# EAGLE design ringmod_1496 (EAGLE 7.1.0)
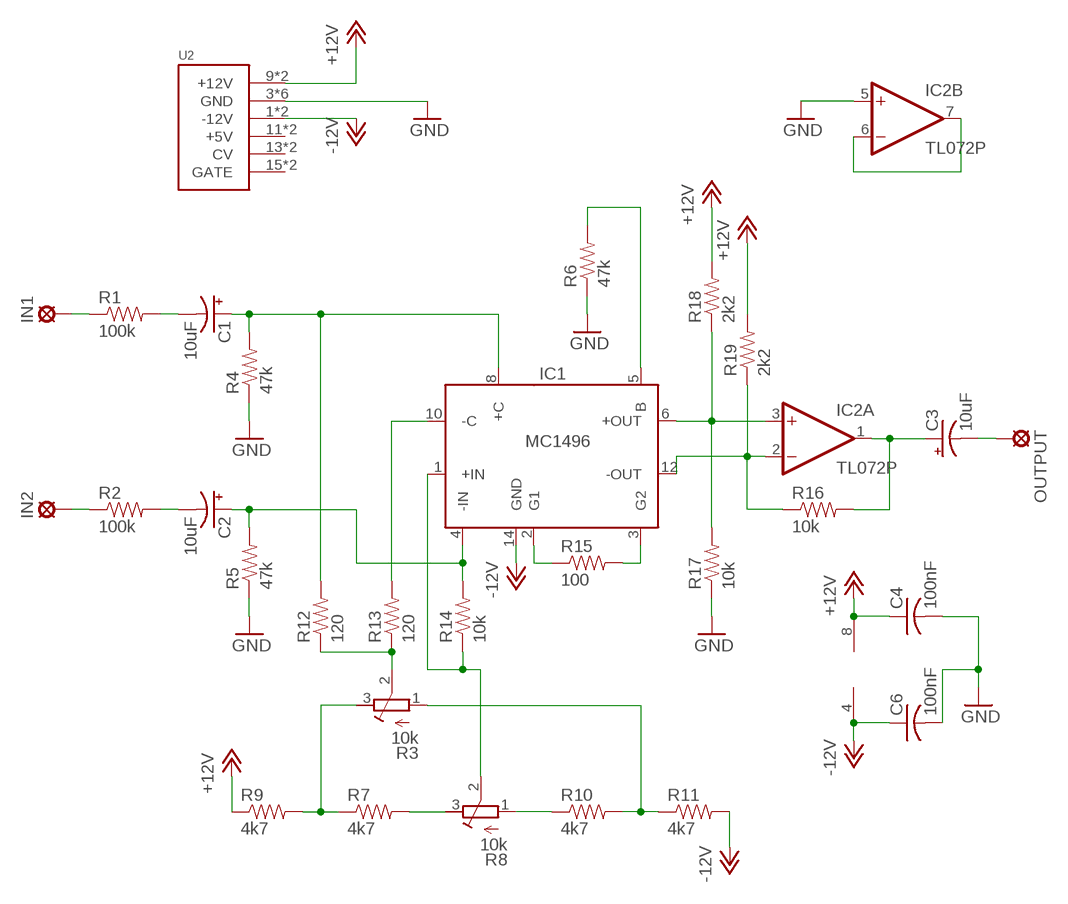
[diagram p0: schematic, sheet 1]

## Parts
C1  10uF  CPOL-USB45181A  [B45181A]
C2  10uF  CPOL-USB45181A  [B45181A]
C3  10uF  CPOL-USB45181A  [B45181A]
C4  100nF  C-US025-024X044  [C025-024X044]
C6  100nF  C-US025-024X044  [C025-024X044]
IC1  MC1496  [MC1496]
IC2  TL072P  [DIL08]
IN1  LSP11  [LSP11]
IN2  LSP11  [LSP11]
OUTPUT  LSP11  [LSP11]
R1  100k  RESISTORPTH-1/4W  [AXIAL-0.4]
R2  100k  RESISTORPTH-1/4W  [AXIAL-0.4]
R3  10k  R-TRIMM64W  [RTRIM64W]
R4  47k  RESISTORPTH-1/4W  [AXIAL-0.4]
R5  47k  RESISTORPTH-1/4W  [AXIAL-0.4]
R6  47k  RESISTORPTH-1/4W  [AXIAL-0.4]
R7  4k7  RESISTORPTH-1/4W  [AXIAL-0.4]
R8  10k  R-TRIMM64W  [RTRIM64W]
R9  4k7  RESISTORPTH-1/4W  [AXIAL-0.4]
R10  4k7  RESISTORPTH-1/4W  [AXIAL-0.4]
R11  4k7  RESISTORPTH-1/4W  [AXIAL-0.4]
R12  120  RESISTORPTH-1/4W  [AXIAL-0.4]
R13  120  RESISTORPTH-1/4W  [AXIAL-0.4]
R14  10k  RESISTORPTH-1/4W  [AXIAL-0.4]
R15  100  RESISTORPTH-1/4W  [AXIAL-0.4]
R16  10k  RESISTORPTH-1/4W  [AXIAL-0.4]
R17  10k  RESISTORPTH-1/4W  [AXIAL-0.4]
R18  2k2  RESISTORPTH-1/4W  [AXIAL-0.4]
R19  2k2  RESISTORPTH-1/4W  [AXIAL-0.4]
U2  POWER  [POWER_16]

## Nets
+12V: C4.1 IC2.8(P:V+) R9.P$1 R18.P$2 R19.P$2 U2.9(+12V) U2.10(+12V)
-12V: C6.1 IC1.14(GND) IC2.4(P:V-) R11.P$2 U2.1(-12V) U2.2(-12V)
GND: C4.2 C6.2 IC2.5(B:+IN) R4.P$1 R5.P$1 R6.P$1 R17.P$1 U2.3(GND) U2.4(GND) U2.5(GND) U2.6(GND) U2.7(GND) U2.8(GND)
N$1: IN1.MP R1.P$1
N$2: IN2.MP R2.P$1
N$3: C1.- R1.P$2
N$4: C2.- R2.P$2
N$5: R3.3(E) R7.P$1 R9.P$2
N$6: IC1.5(B) R6.P$2
N$7: C1.+ IC1.8(+C) R4.P$2 R12.P$2
N$8: C2.+ IC1.4(-IN) R5.P$2 R14.P$2
N$9: R7.P$2 R8.3(E)
N$10: R8.1(A) R10.P$1
N$11: R3.1(A) R10.P$2 R11.P$1
N$12: R3.2(S) R12.P$1 R13.P$1
N$13: IC1.10(-C) R13.P$2
N$14: IC1.1(+IN) R8.2(S) R14.P$1
N$15: IC1.2(G1) R15.P$1
N$16: IC1.3(G2) R15.P$2
N$17: C3.- OUTPUT.MP
N$18: C3.+ IC2.1(A:OUT) R16.P$2
N$19: IC1.12(-OUT) IC2.2(A:-IN) R16.P$1 R19.P$1
N$20: IC1.6(+OUT) IC2.3(A:+IN) R17.P$2 R18.P$1
N$21: IC2.6(B:-IN) IC2.7(B:OUT)
Unconnected: U2.11(+5V) U2.12(+5V) U2.13(CV) U2.14(CV) U2.15(GATE) U2.16(GATE)

## Library data of the parts
C1-C3 = rcl:CPOL-US: POLARIZED CAPACITOR, American symbol
C4 C6 = rcl:C-US: CAPACITOR, American symbol
IC1 = MC1496:MC1496: MC1496
IC2 = linear:TL072: OP AMP
IN1 IN2 OUTPUT = solpad:LSP11: SOLDER PAD drill 1.1 mm
R1 R2 R4-R7 R9-R19 = SparkFun-Resistors:RESISTOR: Resistor Basic schematic elements and footprints for 0603, 1206, and PTH resistors.
R3 R8 = rcl:R-TRIMM: Trimm resistor
U2 = eurorack:POWER

## Board
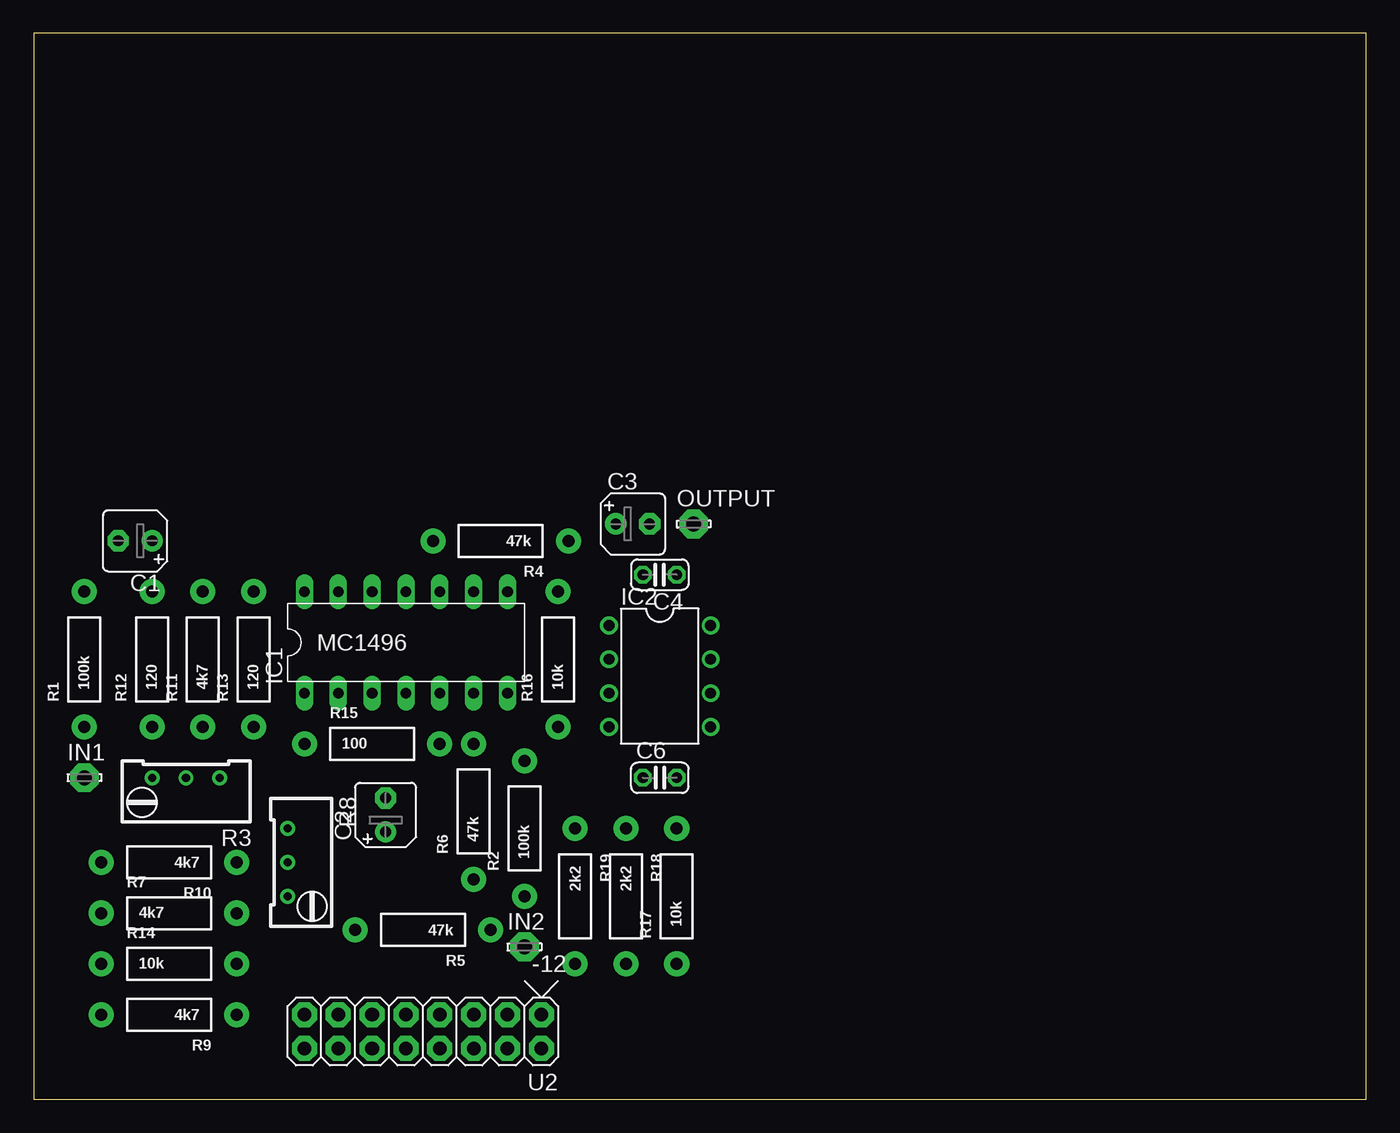
[diagram p1: board, top side]
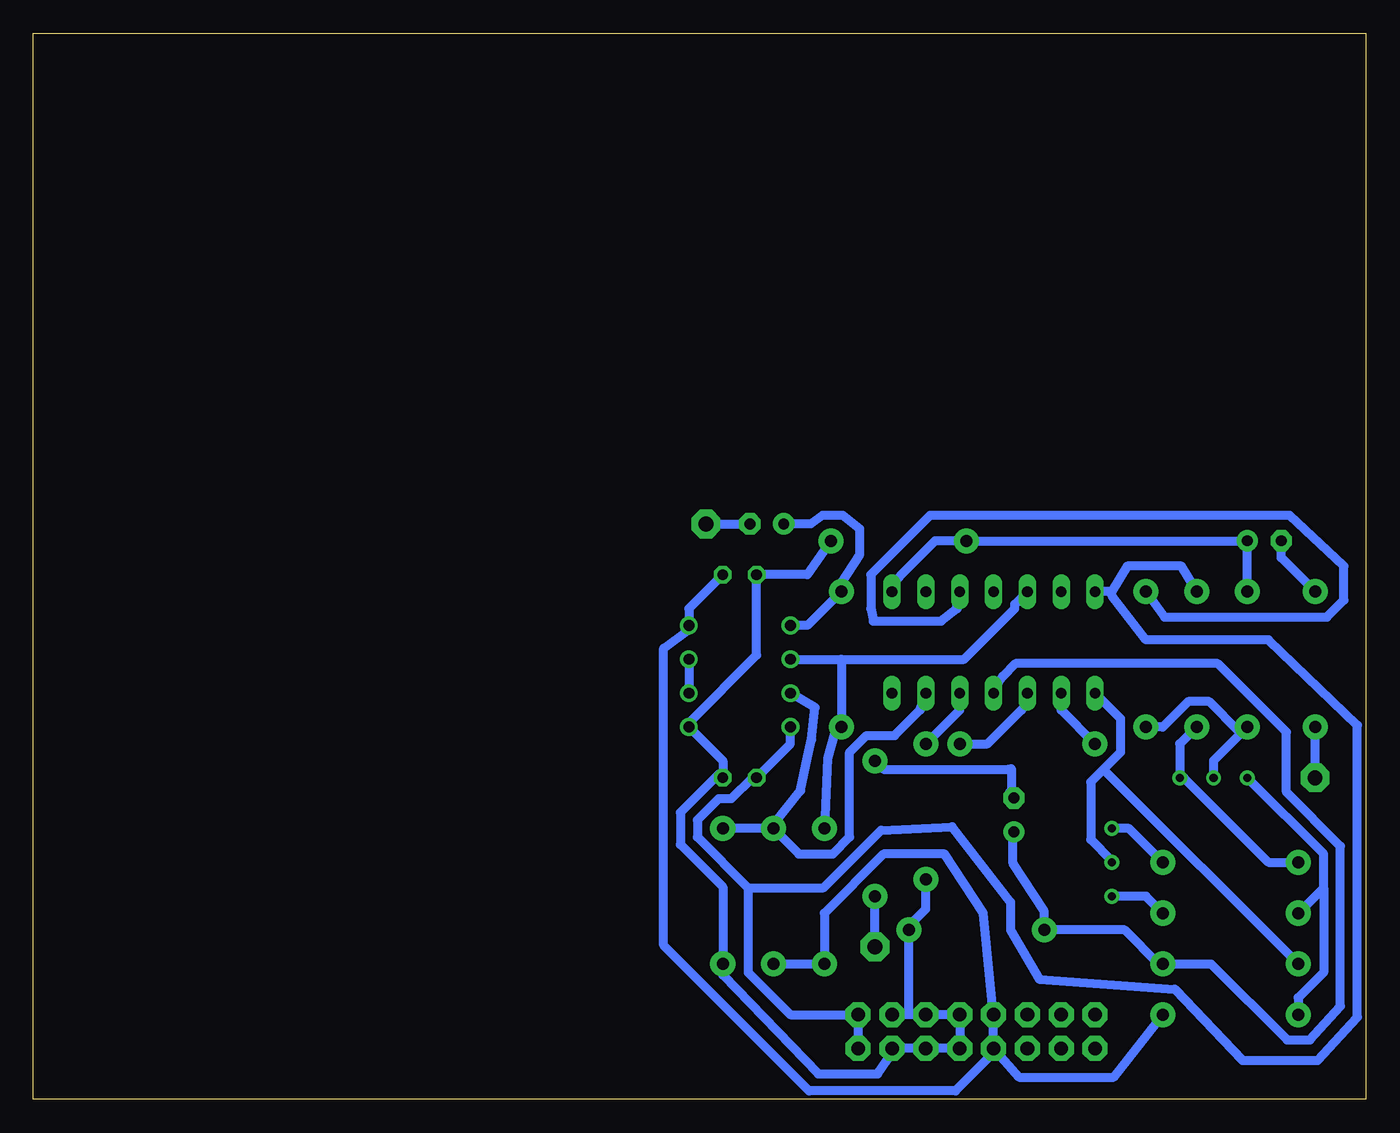
[diagram p2: board, bottom side, seen from below]

Size 100 x 80 mm. Coordinates in mm from the lower left corner, seen from the top.
Outline: 0,0 100,0 100,80 0,80 0,0
Copper layers (1*16): Top 0.035mm / dielectric 1.5mm / Bottom 0.035mm
Design rules "default *": minimum track width 26mil, minimum drill 24mil, track to track 18mil, track to pad 18mil, pad to pad 18mil, via to via 18mil, smd to smd 8mil, copper to edge 0mil, drill to drill 8mil, minimum pad ring 10mil, minimum via ring 8mil, stop-mask expansion 4mil, vias tented up to drill 0mil, thermal gap 10mil

### Footprints (pad centres in the part's own frame; a part is rotated, then mirrored left to right if it is on the bottom)
B45181A = drill 0.813 pad 1.6: + -1.27,0 | drill 0.813 pad 1.6 octagon: - 1.27,0
C025-024X044 = drill 0.813 octagon: 1 -1.27,0; 2 1.27,0
MC1496 = drill 0.8 long: 1 -7.62,-3.81; 2 -5.08,-3.81; 3 -2.54,-3.81; 4 0,-3.81; 5 2.54,-3.81; 6 5.08,-3.81; 7 7.62,-3.81; 8 7.62,3.81; 9 5.08,3.81; 10 2.54,3.81; 11 0,3.81; 12 -2.54,3.81; 13 -5.08,3.81; 14 -7.62,3.81
DIL08 = drill 0.813 pad 1.27: 1 -3.81,-3.81; 2 -1.27,-3.81; 3 1.27,-3.81; 4 3.81,-3.81; 5 3.81,3.81; 6 1.27,3.81; 7 -1.27,3.81; 8 -3.81,3.81
LSP11 = drill 1.118 pad 2.159 octagon: MP 0,0
AXIAL-0.4 = drill 0.9 pad 1.88: P$1 -5.08,0; P$2 5.08,0
RTRIM64W = drill 0.61: 1 1.27,-2.54; 2 1.27,0; 3 1.27,2.54
POWER_16 = drill 1.016 pad 1.88 octagon: 1 -6.35,-1.27; 2 -6.35,1.27; 3 -3.81,-1.27; 4 -3.81,1.27; 5 -1.27,-1.27; 6 -1.27,1.27; 7 1.27,-1.27; 8 1.27,1.27; 9 3.81,-1.27; 10 3.81,1.27; 11 6.35,-1.27; 12 6.35,1.27; 13 8.89,-1.27; 14 8.89,1.27; 15 11.43,-1.27; 16 11.43,1.27

### Placement (x,y rotation side)
C1  7.62,41.91 180 top
C2  26.42,21.34 90 top
C3  44.96,43.18 0 top
C4  46.99,39.37 180 top
C6  46.99,24.13 0 top
IC1  27.94,34.29 0 top
IC2  46.99,31.75 270 top
IN1  3.81,24.13 0 top
IN2  36.83,11.43 0 top
OUTPUT  49.53,43.18 0 top
R1  3.81,33.02 90 top
R2  36.83,20.32 90 top
R3  11.43,22.86 90 top
R4  35.05,41.91 180 top
R5  29.21,12.7 180 top
R6  33.02,21.59 90 top
R7  10.16,13.97 0 top
R8  20.32,17.78 180 top
R9  10.16,6.35 180 top
R10  10.16,17.78 180 top
R11  12.7,33.02 90 top
R12  8.89,33.02 90 top
R13  16.51,33.02 90 top
R14  10.16,10.16 0 top
R15  25.4,26.67 0 top
R16  39.37,33.02 90 top
R17  48.26,15.24 90 top
R18  44.45,15.24 270 top
R19  40.64,15.24 270 top
U2  31.75,5.08 180 top

### Tracks (layer width: path | path; a pad name or v marks a point on that pad's centre or on a via)
+12V
  Bottom 0.66: R18.P$2 R19.P$2 40.64,13.97 36.2,18.41 31.62,18.41 28.7,13.97 U2.9 U2.10 | C4.1 50.8,36.83 IC2.8 50.8,35.24 52.7,33.85 52.7,11.56 41.78,0.64 30.8,0.64 27.94,3.49 U2.10 | R9.P$1 18.92,1.65 26.04,1.65 U2.10
-12V
  Bottom 0.66: 19.05,38.1 IC1.14 | 19.05,38.1 17.91,40.01 13.84,40.01 R11.P$2 | U2.2 U2.1 43.18,6.35 46.35,9.53 46.35,15.88 | IC2.4 43.18,26.67 C6.1 46.04,24.13 47.62,22.54 48.58,22.54 50.16,20.95 50.16,19.68 46.35,15.88 | 46.35,15.88 40.7,15.88 36.39,20.19 31.05,20.45 26.67,14.8 26.67,12.7 24.51,9.02 14.35,8.26 9.27,2.92 3.62,2.92 0.64,6.16 0.64,28.07 7.3,34.48 16.51,34.48 19.05,37.78 19.05,38.1
GND
  Bottom 0.66: 34.29,6.35 U2.5 U2.7 U2.8 U2.6 U2.4 35.56,3.49 36.64,1.91 41.08,1.91 48.26,9.34 R17.P$1 48.26,15.94 51.44,19.11 51.44,21.53 48.58,24.38 C6.2 48.26,25.4 IC2.5 50.8,28.26 45.72,33.34 C4.2 41.91,39.37 R4.P$1 | 34.29,6.35 U2.3 | 34.29,6.35 R5.P$1 34.29,13.02 33.02,14.29 R6.P$1
N$1
  Bottom 0.66: IN1.MP R1.P$1
N$2
  Bottom 0.66: IN2.MP R2.P$1
N$3
  Bottom 0.66: C1.- 6.35,40.64 R1.P$2
N$4
  Bottom 0.66: C2.- 26.86,22.8 26.73,23.05 26.61,22.16 26.61,24.83 26.8,24.77 36.2,24.77 R2.P$2
N$5
  Bottom 0.66: R3.3 3.17,18.41 3.17,15.88 | R7.P$1 3.17,15.88 | R9.P$2 5.08,7.62 3.17,9.53 3.17,15.88
N$6
  Bottom 0.66: IC1.5 30.48,29.21 R6.P$2
N$7
  Bottom 0.66: R12.P$2 C1.+ R4.P$2 32.32,41.91 34.86,39.37 35.37,38.8 IC1.8
N$8
  Bottom 0.66: C2.+ 26.48,20.13 26.35,20.13 26.48,19.49 26.48,17.72 24.13,14.1 R5.P$2 18.1,12.7 15.56,10.16 R14.P$2 11.62,10.16 5.91,4.45 4.19,4.45 1.91,6.99 1.91,18.99 5.97,23.05 5.97,27.56 11.11,32.7 26.29,32.7 27.24,31.75 27.5,31.43 IC1.4
N$9
  Bottom 0.66: R8.3 16.51,15.24 R7.P$2
N$10
  Bottom 0.66: R8.1 17.78,20.32 R10.P$1
N$11
  Bottom 0.66: R11.P$1 13.97,26.67 R3.1 13.65,24.13 7.3,17.78 R10.P$2
N$12
  Bottom 0.66: R3.2 11.43,25.4 R12.P$1 9.53,27.62 11.75,29.84 13.34,29.84 15.24,27.94 R13.P$1
N$13
  Bottom 0.66: IC1.10 30.67,37.15 30.67,36.83 31.88,35.88 36.96,35.88 37.15,36.83 37.15,39.37 32.7,43.81 5.71,43.81 1.65,40.01 1.65,37.47 2.92,36.2 15.11,36.2 R13.P$2
N$14
  Bottom 0.66: R8.2 19.05,17.91 20.64,19.49 20.64,23.81 19.68,24.77 | 19.68,24.77 18.41,26.04 18.41,28.57 IC1.1 | 19.68,24.77 R14.P$1
N$15
  Bottom 0.66: IC1.2 22.86,29.21 R15.P$1
N$16
  Bottom 0.66: IC1.3 25.59,29.53 25.84,29.21 28.38,26.67 R15.P$2
N$17
  Bottom 0.66: OUTPUT.MP C3.-
N$18
  Bottom 0.66: IC2.1 41.91,35.56 R16.P$2 39.37,38.73 37.97,40.89 37.97,42.8 39.24,43.81 40.77,43.81 41.66,43.18 C3.+
N$19
  Bottom 0.66: IC1.12 26.35,37.15 26.35,36.83 30.16,33.02 39.37,33.02 | IC2.2 39.37,33.02 | 39.37,33.02 R16.P$1 39.62,28.38 40.39,25.59 R19.P$1
N$20
  Bottom 0.66: IC1.6 33.47,29.27 33.47,29.21 35.37,27.3 37.47,27.3 38.73,26.04 38.73,19.68 40.01,18.41 42.55,18.41 R18.P$1 | IC2.3 41.34,29.4 41.59,26.99 41.91,25.65 42.42,23.18 44.45,20.64 R18.P$1 | R18.P$1 R17.P$2
N$21
  Bottom 0.66: IC2.7 IC2.6